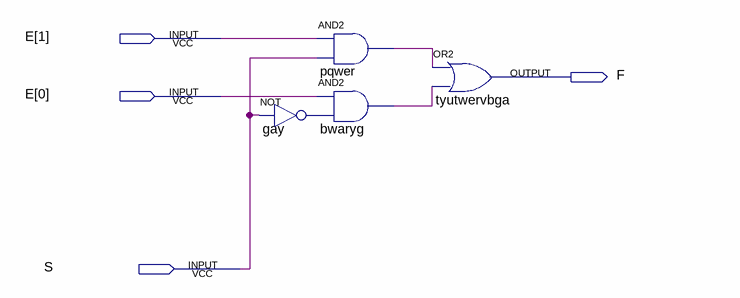
[diagram p0: schematic sheet]
// Quartus schematic mux2.bdf as structural Verilog: 4 symbols, 4 pins
module mux2 (
  input  [1:0] E,
  input  S,
  output F
);

  wire bwaryg_out, gay_out, pqwer_out;

  not gay (gay_out, S);
  and pqwer (pqwer_out, E[1], S);
  and bwaryg (bwaryg_out, E[0], gay_out);
  or tyutwervbga (F, pqwer_out, bwaryg_out);
endmodule
